# Altium schematic sheet Rectifire_(PFC)_Evaluation_Board.SchDoc
size A0; SheetNumber: 1; SheetTotal: 1
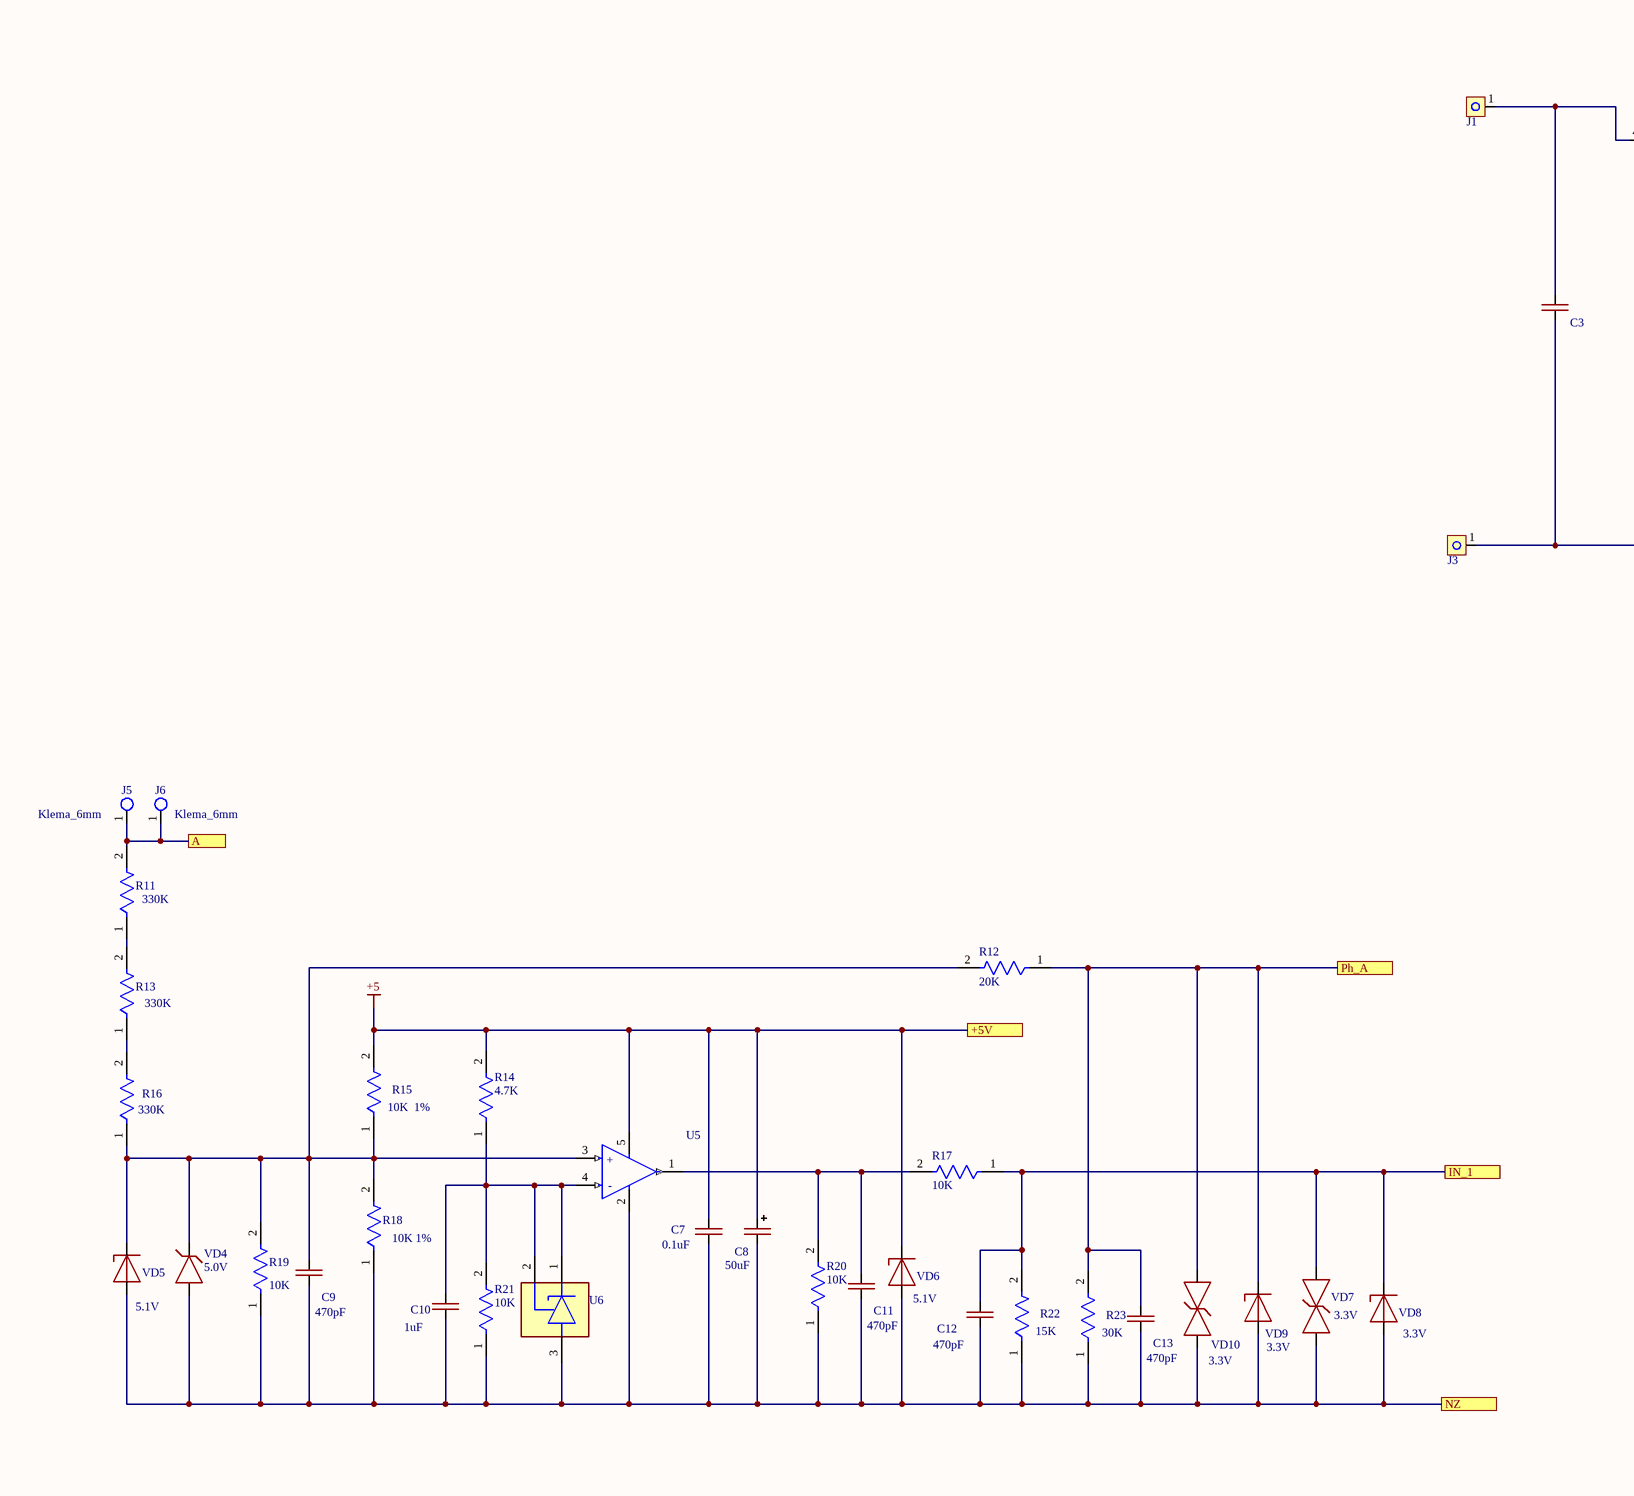
[diagram p0: Rectifire_(PFC)_Evaluation_Board.SchDoc, top left]
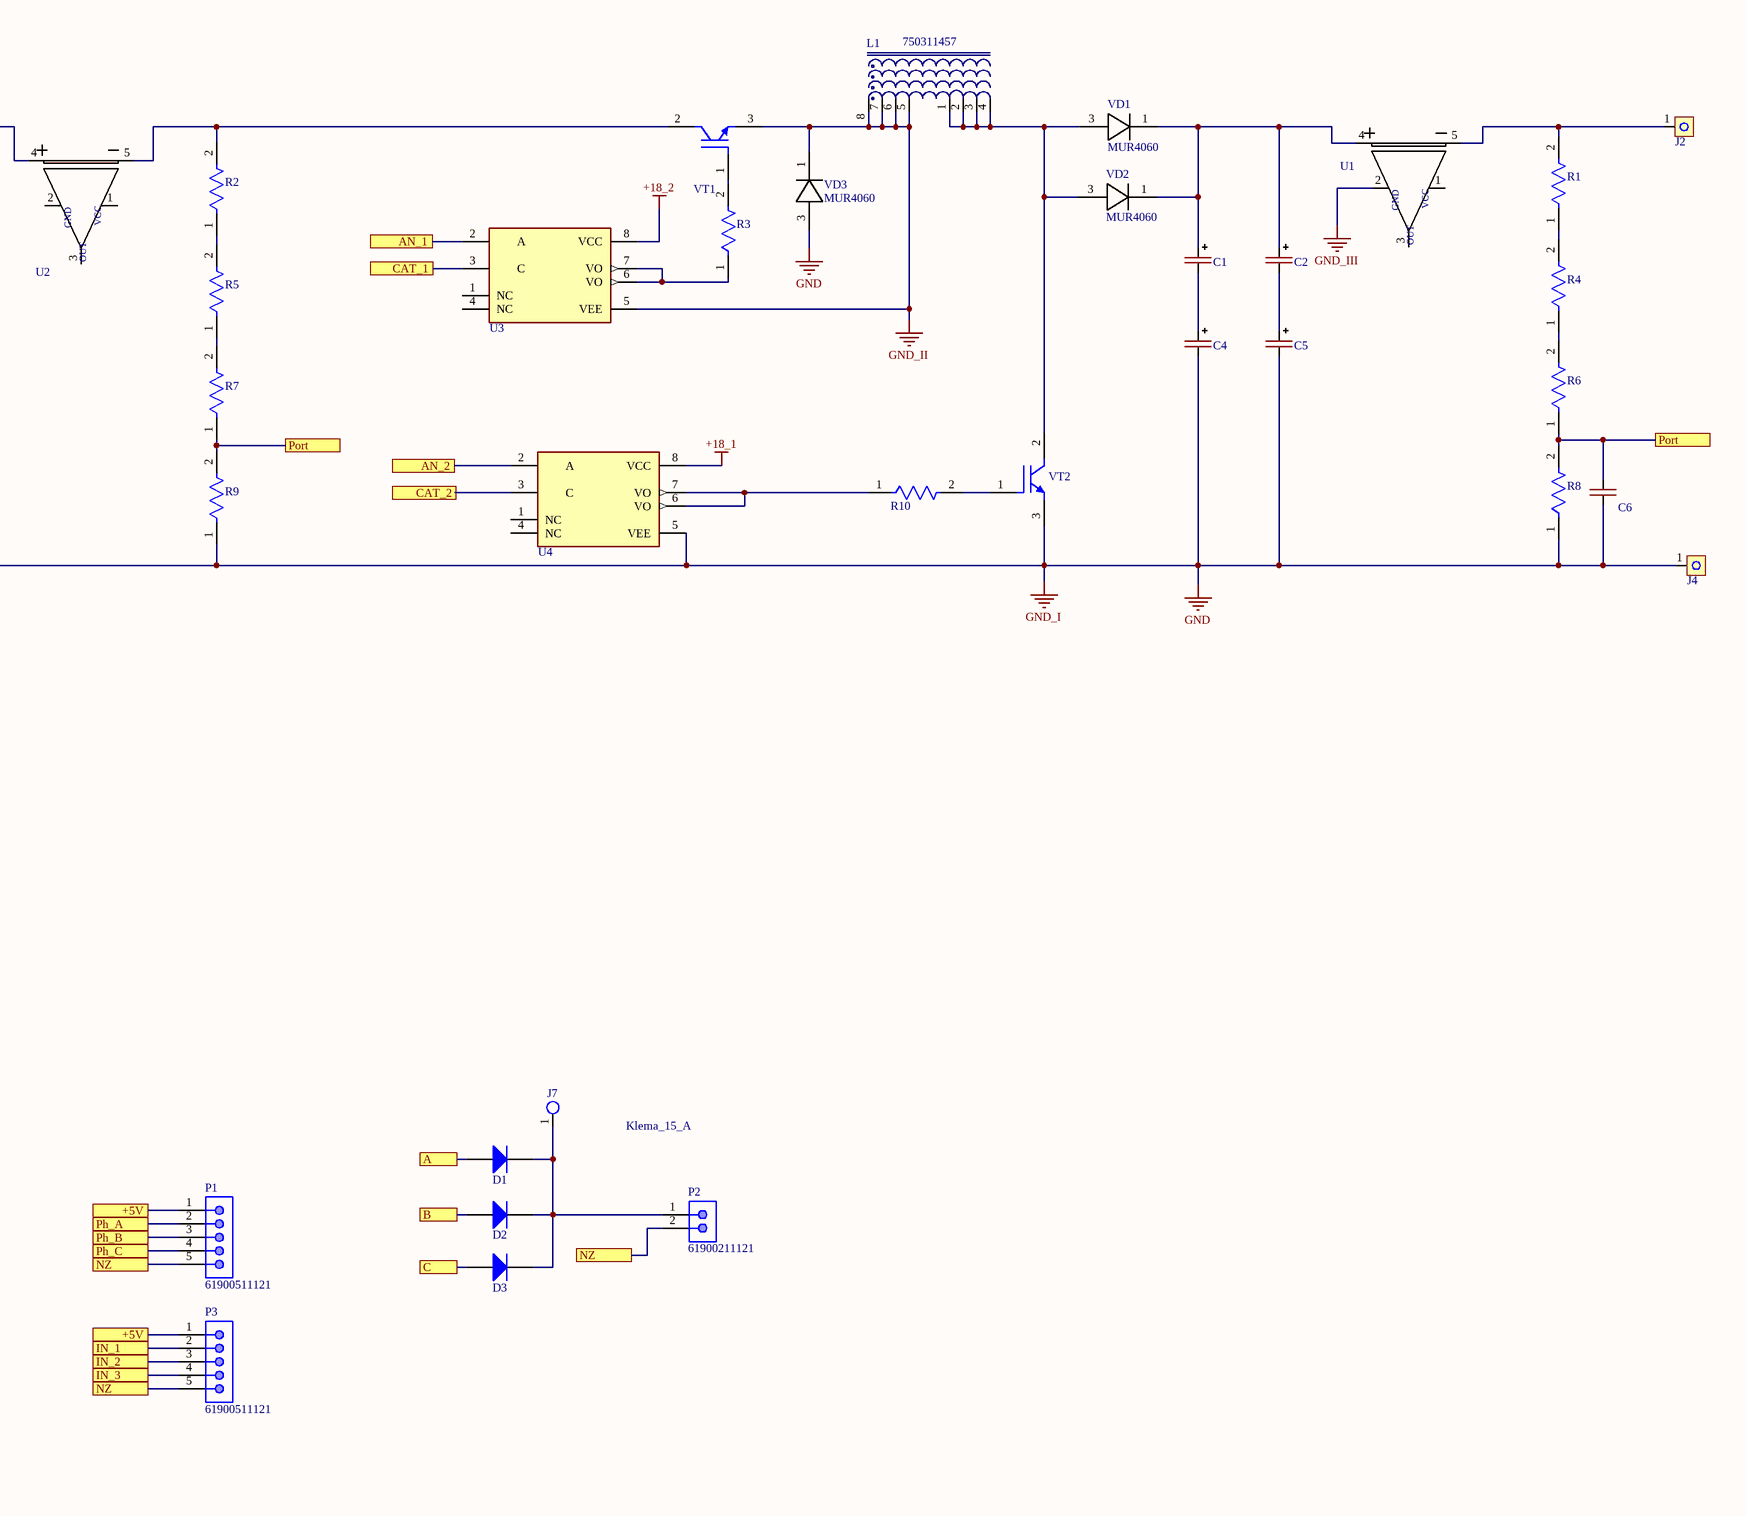
[diagram p1: Rectifire_(PFC)_Evaluation_Board.SchDoc, top right]
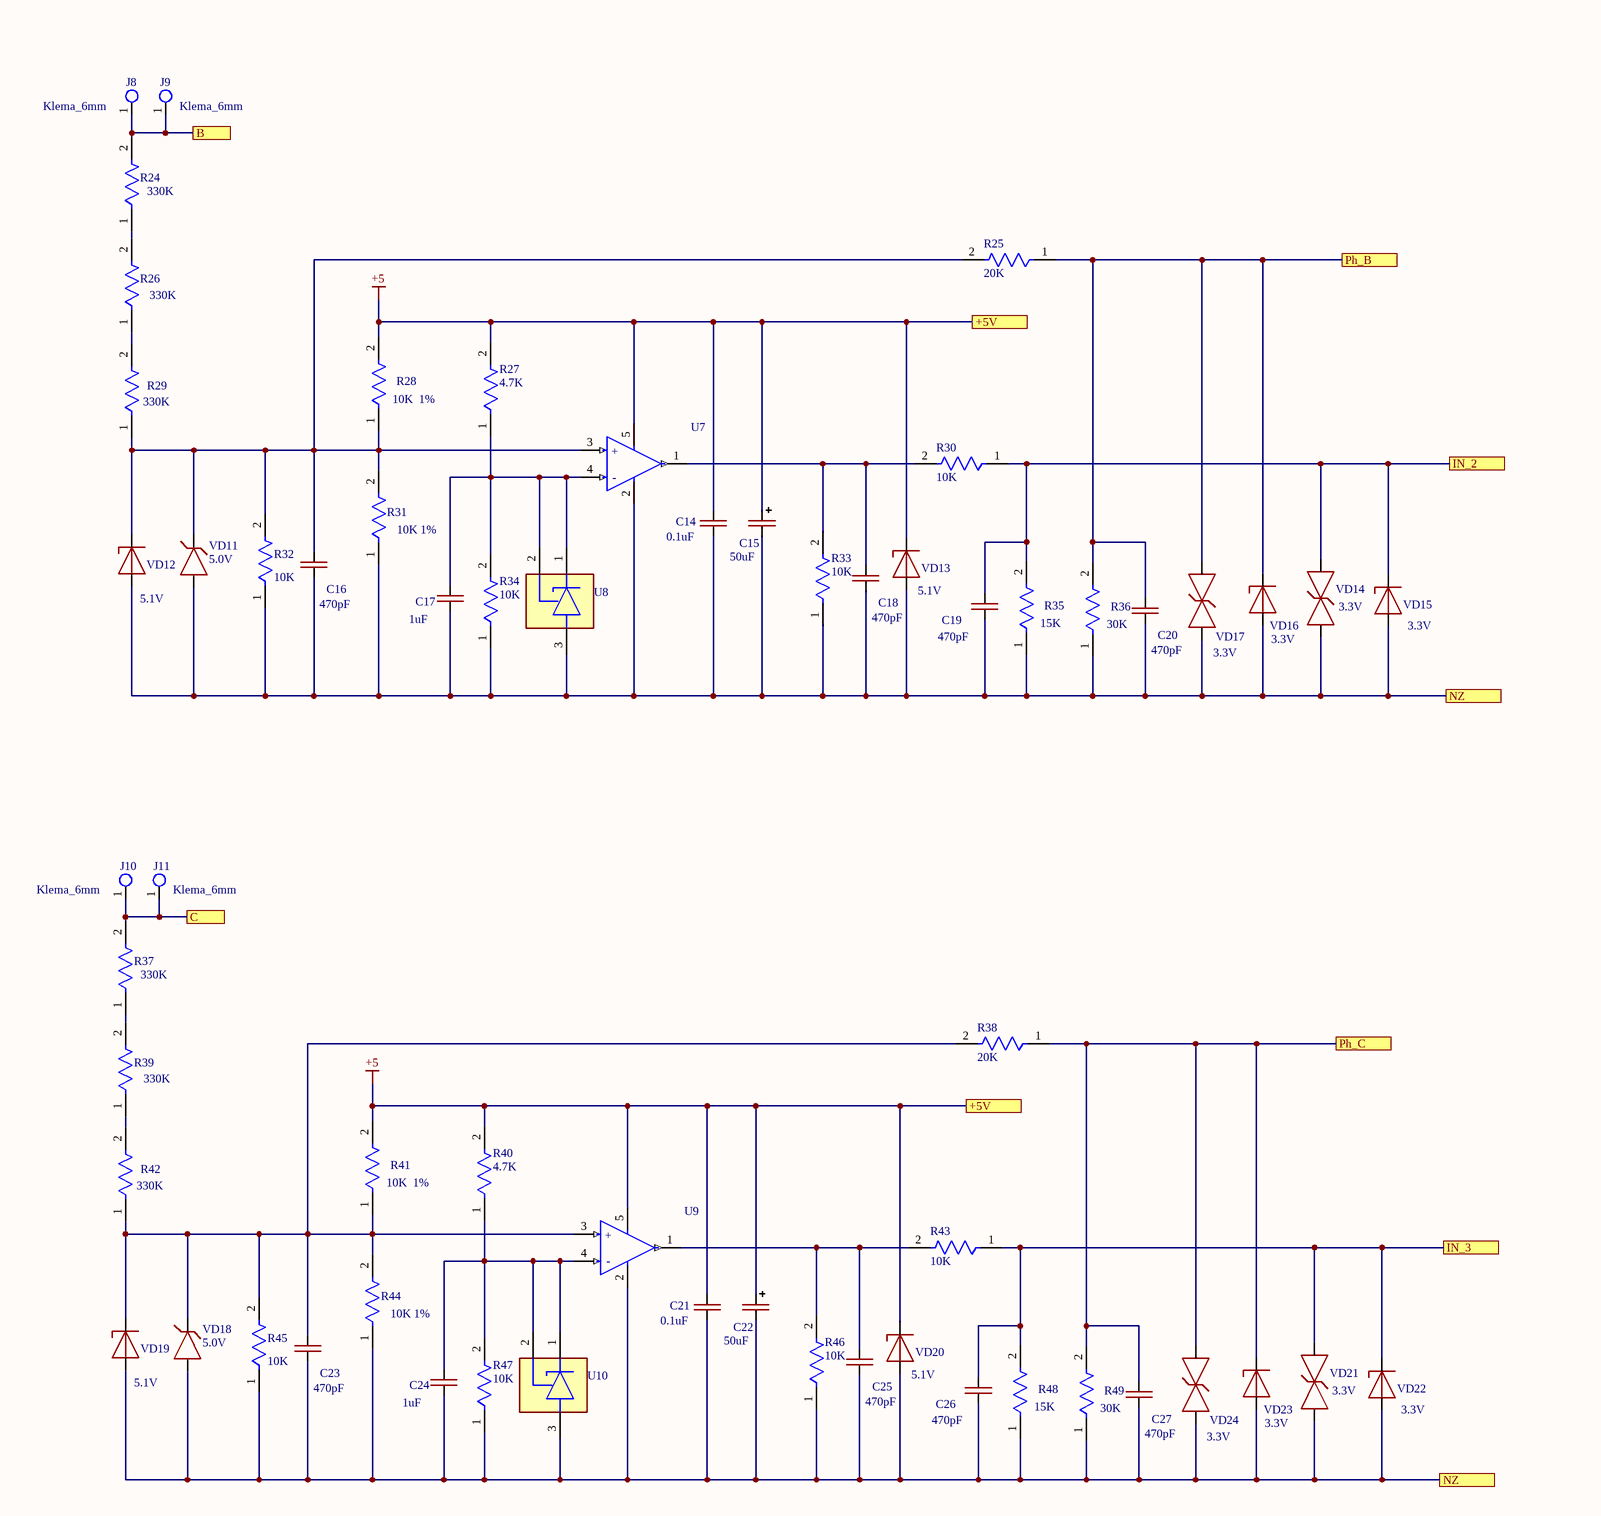
[diagram p2: Rectifire_(PFC)_Evaluation_Board.SchDoc, bottom left]

## Parts
C1  CAP-POLAR  [CAP 100uF_500V 22x40mm]  (value not drawn)
C2  CAP-POLAR  [CAP 100uF_500V 22x40mm]  (value not drawn)
C3  CAP-NON-POLAR  [CAP_4.7uF_630V]  (value not drawn)
C4  CAP-POLAR  [CAP 100uF_500V 22x40mm]  (value not drawn)
C5  CAP-POLAR  [CAP 100uF_500V 22x40mm]  (value not drawn)
C6  CAP-NON-POLAR  [CAP-0805]  (value not drawn)
C7  0.1uF  [CAP-0805]
C8  50uF  [CAP-TAN-D]
C9  470pF  [CAP-0805]
C10  1uF  [CAP-0805]
C11  470pF  [CAP-0805]
C12  470pF  [CAP-0805]
C13  470pF  [CAP-0805]
C14  0.1uF  [CAP-0805]
C15  50uF  [CAP-TAN-D]
C16  470pF  [CAP-0805]
C17  1uF  [CAP-0805]
C18  470pF  [CAP-0805]
C19  470pF  [CAP-0805]
C20  470pF  [CAP-0805]
C21  0.1uF  [CAP-0805]
C22  50uF  [CAP-TAN-D]
C23  470pF  [CAP-0805]
C24  1uF  [CAP-0805]
C25  470pF  [CAP-0805]
C26  470pF  [CAP-0805]
C27  470pF  [CAP-0805]
D1  FR-207  [FP-DO-201AD-MFG]  (value not drawn)
D2  FR-207  [FP-DO-201AD-MFG]  (value not drawn)
D3  FR-207  [FP-DO-201AD-MFG]  (value not drawn)
J1  MG_136_HT  [Conn_MEIGAN_MG136HT]  (value not drawn)
J2  MG_136_HT  [Conn_MEIGAN_MG136HT]  (value not drawn)
J3  MG_136_HT  [Conn_MEIGAN_MG136HT]  (value not drawn)
J4  MG_136_HT  [Conn_MEIGAN_MG136HT]  (value not drawn)
J5  Klema_6mm  [Connector_6mm]
J6  Klema_6mm  [Connector_6mm]
J7  Klema_15_A  [Klema_PCB_15A]
J8  Klema_6mm  [Connector_6mm]
J9  Klema_6mm  [Connector_6mm]
J10  Klema_6mm  [Connector_6mm]
J11  Klema_6mm  [Connector_6mm]
L1  750311457  [Drossel]
P1  61900511121  [61900511121]
P2  61900211121  [61900211121]
P3  61900511121  [61900511121]
R1  RES_1210  [RES_SMD_1210_IPC_B]  (value not drawn)
R2  RES_1210  [RES_SMD_1210_IPC_B]  (value not drawn)
R3  RES_1210  [RES_SMD_1210_IPC_B]  (value not drawn)
R4  RES_1210  [RES_SMD_1210_IPC_B]  (value not drawn)
R5  RES_1210  [RES_SMD_1210_IPC_B]  (value not drawn)
R6  RES_1210  [RES_SMD_1210_IPC_B]  (value not drawn)
R7  RES_1210  [RES_SMD_1210_IPC_B]  (value not drawn)
R8  RES_1210  [RES_SMD_1210_IPC_B]  (value not drawn)
R9  RES_1210  [RES_SMD_1210_IPC_B]  (value not drawn)
R10  RES_1210  [RES_SMD_1210_IPC_B]  (value not drawn)
R11  330K  [RES_SMD_1210_IPC_B]
R12  20K  [RES-0805]
R13  330K  [RES_SMD_1210_IPC_B]
R14  4.7K  [RES-0805]
R15  10K  1%  [RES-0805]
R16  330K  [RES_SMD_1210_IPC_B]
R17  10K  [RES-0805]
R18  10K 1%  [RES-0805]
R19  10K  [RES_SMD_1210_IPC_B]
R20  10K  [RES-0805]
R21  10K  [RES-0805]
R22  15K  [RES-0805]
R23  30K  [RES-0805]
R24  330K  [RES_SMD_1210_IPC_B]
R25  20K  [RES-0805]
R26  330K  [RES_SMD_1210_IPC_B]
R27  4.7K  [RES-0805]
R28  10K  1%  [RES-0805]
R29  330K  [RES_SMD_1210_IPC_B]
R30  10K  [RES-0805]
R31  10K 1%  [RES-0805]
R32  10K  [RES_SMD_1210_IPC_B]
R33  10K  [RES-0805]
R34  10K  [RES-0805]
R35  15K  [RES-0805]
R36  30K  [RES-0805]
R37  330K  [RES_SMD_1210_IPC_B]
R38  20K  [RES-0805]
R39  330K  [RES_SMD_1210_IPC_B]
R40  4.7K  [RES-0805]
R41  10K  1%  [RES-0805]
R42  330K  [RES_SMD_1210_IPC_B]
R43  10K  [RES-0805]
R44  10K 1%  [RES-0805]
R45  10K  [RES_SMD_1210_IPC_B]
R46  10K  [RES-0805]
R47  10K  [RES-0805]
R48  15K  [RES-0805]
R49  30K  [RES-0805]
U1  ACS758  [ACS758-100]  (value not drawn)
U2  ACS758  [ACS758-100]  (value not drawn)
U3  HCPL-3120  [HCPL-3120]  (value not drawn)
U4  HCPL-3120  [HCPL-3120]  (value not drawn)
U5  (no value)  [SOT-23-5]
U6  TL431  [TL431_SOT-23-3(A)]  (value not drawn)
U7  (no value)  [SOT-23-5]
U8  TL431  [TL431_SOT-23-3(A)]  (value not drawn)
U9  (no value)  [SOT-23-5]
U10  TL431  [TL431_SOT-23-3(A)]  (value not drawn)
VD1  MUR4060  [TO-247-2]
VD2  MUR4060  [TO-247-2]
VD3  MUR4060  [TO-247-2]
VD4  5.0V  [SOD-323]
VD5  5.1V  [DIOD-SOD123-2_V]
VD6  5.1V  [DIOD-SOD123-2_V]
VD7  3.3V  [DO-214AA]
VD8  3.3V  [DIOD-SOD123-2_V]
VD9  3.3V  [DIOD-SOD123-2_V]
VD10  3.3V  [DO-214AA]
VD11  5.0V  [SOD-323]
VD12  5.1V  [DIOD-SOD123-2_V]
VD13  5.1V  [DIOD-SOD123-2_V]
VD14  3.3V  [DO-214AA]
VD15  3.3V  [DIOD-SOD123-2_V]
VD16  3.3V  [DIOD-SOD123-2_V]
VD17  3.3V  [DO-214AA]
VD18  5.0V  [SOD-323]
VD19  5.1V  [DIOD-SOD123-2_V]
VD20  5.1V  [DIOD-SOD123-2_V]
VD21  3.3V  [DO-214AA]
VD22  3.3V  [DIOD-SOD123-2_V]
VD23  3.3V  [DIOD-SOD123-2_V]
VD24  3.3V  [DO-214AA]
VT1  IGBT 60N120T  [TO-264-3]  (value not drawn)
VT2  IGBT 60N120T  [TO-264-3]  (value not drawn)

## Ports
+5V, A, AN_1, AN_2, B, C, CAT_1, CAT_2, IN_1, IN_2, IN_3, NZ, Ph_A, Ph_B, Ph_C, Port

## Nets
+5: C7.2 C8.1(+) C14.2 C15.1(+) C21.2 C22.1(+) P1.1 P3.1 R14.2 R15.2 R27.2 R28.2 R40.2 R41.2 U5.5(VDD) U7.5(VDD) U9.5(VDD) VD6.1(C) VD13.1(C) VD20.1(C) ; port +5V
+18_1: U4.8(VCC)
+18_2: U3.8(VCC)
GND: C3.1 C4.2(-) C5.2(-) C6.1 J3.1 J4.1 R8.1 R9.1 U4.5(VEE) VD3.3 VT2.3(E)  [also labelled GND_I]
GND_II: L1.5 L1.6 L1.7 L1.8 U3.5(VEE) VD3.1 VT1.3(E)
GND_III: U1.2(GND)
A: D1.2(A) J5.1 J6.1 R11.2 ; port A
AN_1: U3.2(A) ; port AN_1
AN_2: U4.2(A) ; port AN_2
B: D2.2(A) J8.1 J9.1 R24.2 ; port B
C: D3.2(A) J10.1 J11.1 R37.2 ; port C
CAT_1: U3.3(C) ; port CAT_1
CAT_2: U4.3(C) ; port CAT_2
IN_1: C12.2 P3.2 R17.1 R22.2 VD7.2(A) VD8.1(C) ; port IN_1
IN_2: C19.2 P3.3 R30.1 R35.2 VD14.2(A) VD15.1(C) ; port IN_2
IN_3: C26.2 P3.4 R43.1 R48.2 VD21.2(A) VD22.1(C) ; port IN_3
NZ: C7.1 C8.2(-) C9.1 C10.1 C11.1 C12.1 C13.1 C14.1 C15.2(-) C16.1 C17.1 C18.1 C19.1 C20.1 C21.1 C22.2(-) C23.1 C24.1 C25.1 C26.1 C27.1 P1.5 P2.2 P3.5 R18.1 R19.1 R20.1 R21.1 R22.1 R23.1 R31.1 R32.1 R33.1 R34.1 R35.1 R36.1 R44.1 R45.1 R46.1 R47.1 R48.1 R49.1 U5.2(VSS) U6.3(A) U7.2(VSS) U8.3(A) U9.2(VSS) U10.3(A) VD4.1(A) VD5.2(A) VD6.2(A) VD7.1(C) VD8.2(A) VD9.2(A) VD10.1(C) VD11.1(A) VD12.2(A) VD13.2(A) VD14.1(C) VD15.2(A) VD16.2(A) VD17.1(C) VD18.1(A) VD19.2(A) VD20.2(A) VD21.1(C) VD22.2(A) VD23.2(A) VD24.1(C) ; port NZ
Ph_A: C13.2 P1.2 R12.1 R23.2 VD9.1(C) VD10.2(A) ; port Ph_A
Ph_B: C20.2 P1.3 R25.1 R36.2 VD16.1(C) VD17.2(A) ; port Ph_B
Ph_C: C27.2 P1.4 R38.1 R49.2 VD23.1(C) VD24.2(A) ; port Ph_C
Port: C6.2 R6.1 R7.1 R8.2 R9.2 ; port Port
NetC1_1: C1.1(+) C2.1(+) U1.4(+IP) VD1.1 VD2.1
NetC1_2: C1.2(-) C4.1(+)
NetC2_2: C2.2(-) C5.1(+)
NetC3_2: C3.2 J1.1 U2.4(+IP)
NetC9_2: C9.2 R12.2 R15.1 R16.1 R18.2 R19.2 U5.3(VIN+) VD4.2(C) VD5.1(C)
NetC10_2: C10.2 R14.1 R21.2 U5.4(VIN-) U6.1(C) U6.2(REF)
NetC11_2: C11.2 R17.2 R20.2 U5.1(VOUT)
NetC16_2: C16.2 R25.2 R28.1 R29.1 R31.2 R32.2 U7.3(VIN+) VD11.2(C) VD12.1(C)
NetC17_2: C17.2 R27.1 R34.2 U7.4(VIN-) U8.1(C) U8.2(REF)
NetC18_2: C18.2 R30.2 R33.2 U7.1(VOUT)
NetC23_2: C23.2 R38.2 R41.1 R42.1 R44.2 R45.2 U9.3(VIN+) VD18.2(C) VD19.1(C)
NetC24_2: C24.2 R40.1 R47.2 U9.4(VIN-) U10.1(C) U10.2(REF)
NetC25_2: C25.2 R43.2 R46.2 U9.1(VOUT)
NetD1_1: D1.1(K) D2.1(K) D3.1(K) J7.1 P2.1
NetJ2_1: J2.1 R1.2 U1.5(-IP)
NetL1_1: L1.1 L1.2 L1.3 L1.4 VD1.3 VD2.3 VT2.2(C)
NetR1_1: R1.1 R4.2
NetR2_1: R2.1 R5.2
NetR2_2: R2.2 U2.5(-IP) VT1.2(C)
NetR3_1: R3.1 U3.6(VO) U3.7(VO)
NetR3_2: R3.2 VT1.1(G)
NetR4_1: R4.1 R6.2
NetR5_1: R5.1 R7.2
NetR10_1: R10.1 U4.6(VO) U4.7(VO)
NetR10_2: R10.2 VT2.1(G)
NetR11_1: R11.1 R13.2
NetR13_1: R13.1 R16.2
NetR24_1: R24.1 R26.2
NetR26_1: R26.1 R29.2
NetR37_1: R37.1 R39.2
NetR39_1: R39.1 R42.2

Not connected (* = marked no-connect by the designer): U1 1(+VCC) 3(OUT); U2 1(+VCC) 2(GND) 3(OUT); U3 1(NC) 4(NC); U4 1(NC) 4(NC)

## Notes on the sheet
- (in symbol ACS758) VCC
- (in symbol MCP6001T) +; -

## Library data of the parts
C7 C9-C14 C16-C21 C23-C27 = CAP-NON-POLAR
C8 C15 C22 = CAP-POLAR
D1-D3 = FR-207: FR207
J1-J4 = Connector_MEIGAN_MG136HT
J5 J6 J8-J11 = Klema_15_A
L1 = DROSEL: Manufacturer: Wuerth Elektronik; Ui: 36V; ComponentLink1Description: Manufacturer URL; ComponentLink2Description: Datasheet; ComponentLink1URL: http://www.we-online.com; PartNumber: 750311457; PackageReference: EP13; ComponentLink2URL: http://katalog.we-online.de/pbs/datasheet/750311457.pdf
P1 P3 = 61900511121: WR-WTB THT Male Vertical Locking Header, pitch 2.54mm, 5p; Pin Number: 5; Contact Resistance: 20mOhm; Rated Current: 3A; Withstanding Voltage: 1000VAC; Working Voltage: 250VAC; ComponentLink1Description: Manufacturer; ComponentLink1URL: http://www.we-online.de; ComponentLink2Description: Datasheet; ComponentLink2URL: https://www.we-online.com/catalog/datasheet/61900511121.pdf; Pitch: 2.54mm; Published Date: January 2020; Publisher: Wurth Elektronik; Mounting Technology: THT; Packaging: Bag; Operating Temperature: -40 to +105degC; Part Number: 61900511121; Gender: Male; Type: Vertical
P2 = 61900211121: WR-WTB THT Male Vertical Locking Header, pitch 2.54mm, 2p; Pin Number: 2; Contact Resistance: 20mOhm; Rated Current: 3A; Withstanding Voltage: 1000VAC; Working Voltage: 250VAC; ComponentLink1Description: Manufacturer; ComponentLink1URL: http://www.we-online.de; ComponentLink2Description: Datasheet; ComponentLink2URL: https://www.we-online.com/catalog/datasheet/61900211121.pdf; Pitch: 2.54mm; Published Date: January 2020; Publisher: Wurth Elektronik; Mounting Technology: THT; Packaging: Bag; Operating Temperature: -40 to +105degC; Part Number: 61900211121; Gender: Male; Type: Vertical
R11 R13 R16 R19 R24 R26 R29 R32 R37 R39 R42 R45 = RES_1210
R12 R14 R17 R20-R23 R25 R27 R30 R33-R36 R38 R40 R43 R46-R49 = RES-CONST
R15 R18 R28 R31 R41 R44 = RES-CONST: 10K
U5 U7 U9 = MCP6001T: IC OPAMP GP 1 CIRCUIT SOT23-5; Number of Amplifiers: 1; Voltage: 6V; Power Supply Rejection Ratio (PSRR): 86dB; Common Mode Rejection Ratio: 60dB; Unity Gain Bandwidth Product: 1MHz; Slew Rate: 0.6V/µs; Output Current per Channel: 23mA; Nominal Supply Current: 100uA; Input Offset Voltage (Vos): 4.5mV; Input Bias Current: 1pA; Operating Supply Voltage: 5.5V; Min Supply Voltage: 1.8V; Voltage Gain: 112dB; Length: 3.1mm; REACH SVHC: No SVHC; Number of Pins: 5; Package Quantity: 1; Radiation Hardening: No; Mount: Surface Mount; Number of Circuits: 1; Number of Elements: 1; Output Current: 23mA; Packaging: Tape and Reel; Height: 1.3mm; Lead Free: Lead Free; Min Operating Temperature: -40°C; Bandwidth: 1MHz; Contact Plating: Tin; Max Supply Voltage: 6V; Max Operating Temperature: 85°C; Width: 1.8mm; Case/Package: SOT-23; Operating Supply Current: 100uA; Number of Channels: 1; Gain Bandwidth Product: 1MHz
U6 U8 U10 = TL431_SOT-23-3
VD4 VD11 VD18 = SMBJ15A
VD5 VD6 VD8 VD9 VD12 VD13 VD15 VD16 VD19 VD20 VD22 VD23 = ZENER
VD7 VD10 VD14 VD17 VD21 VD24 = Suppressor
VT1 VT2 = IGBT 60N120T: IGBT 60N120T TO-264-3